# EAGLE design R3-URC18-4-002-002 (EAGLE 8.3.2)
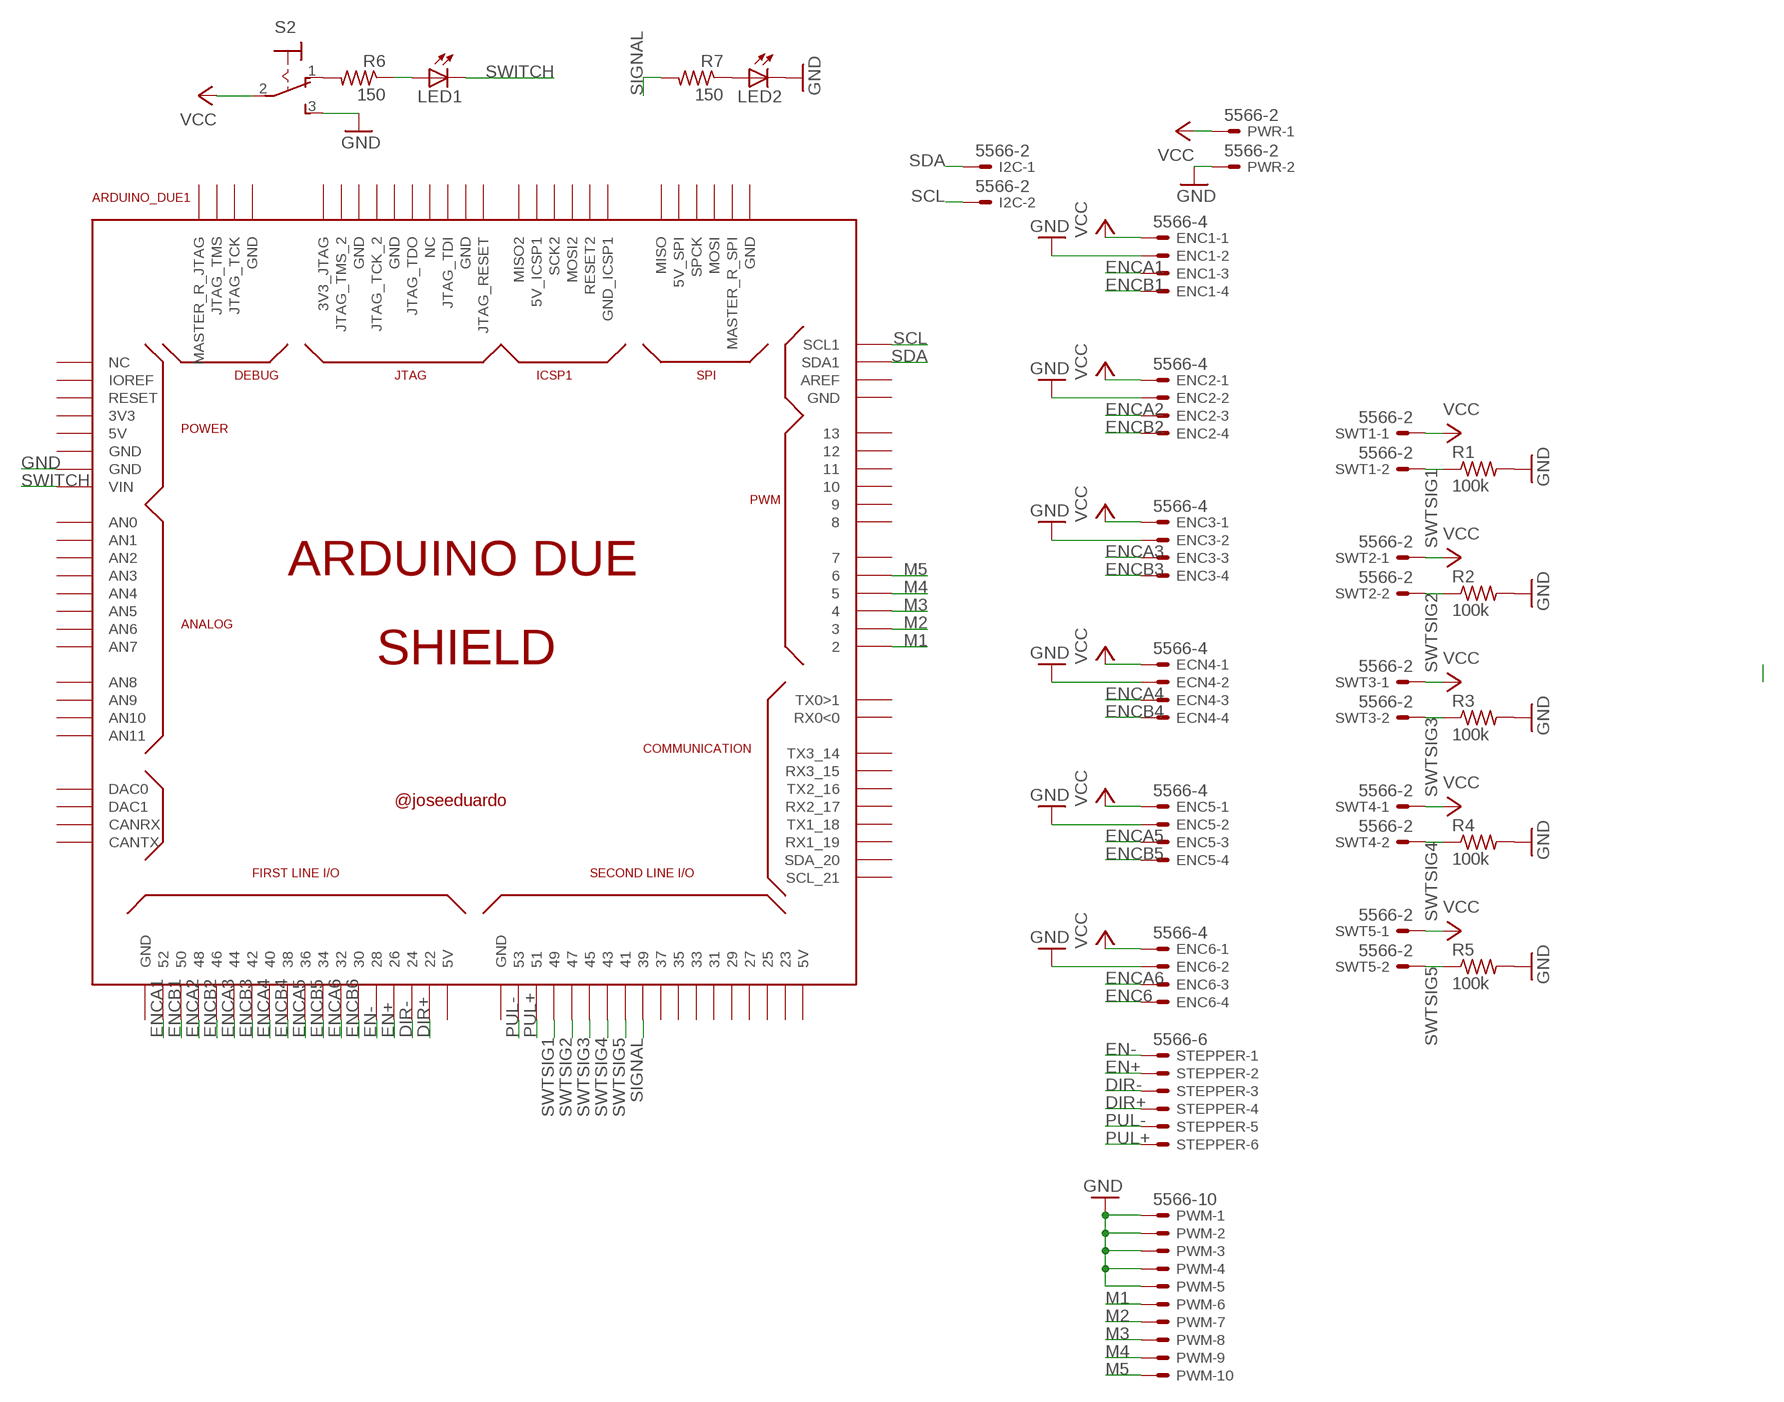
[diagram p0: schematic, sheet 1]

## Parts
ARDUINO_DUE1  ARDUINO_DUE_SHIELD  [ARDUINO_DUE_SHIELD]
ECN4  5566-4  [5566-4]
ENC1  5566-4  [5566-4]
ENC2  5566-4  [5566-4]
ENC3  5566-4  [5566-4]
ENC5  5566-4  [5566-4]
ENC6  5566-4  [5566-4]
I2C  5566-2  [5566-2]
LED1  LED5MM  [LED5MM]
LED2  LED5MM  [LED5MM]
PWM  5566-10  [5566-10]
PWR  5566-2  [5566-2]
R1  100k  R-US_0207/10  [0207/10]
R2  100k  R-US_0207/10  [0207/10]
R3  100k  R-US_0207/10  [0207/10]
R4  100k  R-US_0207/10  [0207/10]
R5  100k  R-US_0207/10  [0207/10]
R6  150  R-US_0207/10  [0207/10]
R7  150  R-US_0207/10  [0207/10]
S2  M9040P  [M9040P]
STEPPER  5566-6  [5566-6]
SWT1  5566-2  [5566-2]
SWT2  5566-2  [5566-2]
SWT3  5566-2  [5566-2]
SWT4  5566-2  [5566-2]
SWT5  5566-2  [5566-2]

## Nets
DIR+: ARDUINO_DUE1.22 STEPPER.4
DIR-: ARDUINO_DUE1.24 STEPPER.3
EN+: ARDUINO_DUE1.26 STEPPER.2
EN-: ARDUINO_DUE1.28 STEPPER.1
ENC6: ENC6.4
ENCA1: ARDUINO_DUE1.52 ENC1.3
ENCA2: ARDUINO_DUE1.48 ENC2.3
ENCA3: ARDUINO_DUE1.44 ENC3.3
ENCA4: ARDUINO_DUE1.40 ECN4.3
ENCA5: ARDUINO_DUE1.36 ENC5.3
ENCA6: ARDUINO_DUE1.32 ENC6.3
ENCB1: ARDUINO_DUE1.50 ENC1.4
ENCB2: ARDUINO_DUE1.46 ENC2.4
ENCB3: ARDUINO_DUE1.42 ENC3.4
ENCB4: ARDUINO_DUE1.38 ECN4.4
ENCB5: ARDUINO_DUE1.34 ENC5.4
ENCB6: ARDUINO_DUE1.30
GND: ARDUINO_DUE1.GND_1(GND) ECN4.2 ENC1.2 ENC2.2 ENC3.2 ENC5.2 ENC6.2 LED2.K(C) PWM.1 PWM.2 PWM.3 PWM.4 PWM.5 PWR.2 R1.2 R2.2 R3.2 R4.2 R5.2 S2.3(S)
M1: ARDUINO_DUE1.2 PWM.6
M2: ARDUINO_DUE1.3 PWM.7
M3: ARDUINO_DUE1.4 PWM.8
M4: ARDUINO_DUE1.5 PWM.9
M5: ARDUINO_DUE1.6 PWM.10
N$1: R6.2 S2.1(O)
N$2: LED1.A R6.1
N$3: LED2.A R7.1
PUL+: ARDUINO_DUE1.51 STEPPER.6
PUL-: ARDUINO_DUE1.53 STEPPER.5
SCL: ARDUINO_DUE1.SCL1 I2C.2
SDA: ARDUINO_DUE1.SDA1 I2C.1
SIGNAL: ARDUINO_DUE1.39 R7.2
SWITCH: ARDUINO_DUE1.VIN LED1.K(C)
SWTSIG1: ARDUINO_DUE1.49 R1.1 SWT1.2
SWTSIG2: ARDUINO_DUE1.47 R2.1 SWT2.2
SWTSIG3: ARDUINO_DUE1.45 R3.1 SWT3.2
SWTSIG4: ARDUINO_DUE1.43 R4.1 SWT4.2
SWTSIG5: ARDUINO_DUE1.41 R5.1 SWT5.2
VCC: ECN4.1 ENC1.1 ENC2.1 ENC3.1 ENC5.1 ENC6.1 PWR.1 S2.2(P) SWT1.1 SWT2.1 SWT3.1 SWT4.1 SWT5.1
Unconnected: ARDUINO_DUE1.0(RX0<0) ARDUINO_DUE1.1(TX0>1) ARDUINO_DUE1.3V3 ARDUINO_DUE1.3V3_JTAG ARDUINO_DUE1.5V0(5V) ARDUINO_DUE1.5V0_1(5V) ARDUINO_DUE1.5V0_2(5V) ARDUINO_DUE1.5V_2(5V_SPI) ARDUINO_DUE1.5V_ICSP1 ARDUINO_DUE1.7 ARDUINO_DUE1.8 ARDUINO_DUE1.9 ARDUINO_DUE1.10 ARDUINO_DUE1.11 ARDUINO_DUE1.12 ARDUINO_DUE1.13 ARDUINO_DUE1.14(TX3_14) ARDUINO_DUE1.15(RX3_15) ARDUINO_DUE1.16(TX2_16) ARDUINO_DUE1.17(RX2_17) ARDUINO_DUE1.18(TX1_18) ARDUINO_DUE1.19(RX1_19) ARDUINO_DUE1.20(SDA_20) ARDUINO_DUE1.21(SCL_21) ARDUINO_DUE1.23 ARDUINO_DUE1.25 ARDUINO_DUE1.27 ARDUINO_DUE1.29 ARDUINO_DUE1.31 ARDUINO_DUE1.33 ARDUINO_DUE1.35 ARDUINO_DUE1.37 ARDUINO_DUE1.A0(AN0) ARDUINO_DUE1.A1(AN1) ARDUINO_DUE1.A2(AN2) ARDUINO_DUE1.A3(AN3) ARDUINO_DUE1.A4(AN4) ARDUINO_DUE1.A5(AN5) ARDUINO_DUE1.A6(AN6) ARDUINO_DUE1.A7(AN7) ARDUINO_DUE1.A8(AN8) ARDUINO_DUE1.A9(AN9) ARDUINO_DUE1.A10(AN10) ARDUINO_DUE1.A11(AN11) ARDUINO_DUE1.AREF ARDUINO_DUE1.CANRX ARDUINO_DUE1.CANTX ARDUINO_DUE1.DAC0 ARDUINO_DUE1.DAC1 ARDUINO_DUE1.GND ARDUINO_DUE1.GND_2(GND) ARDUINO_DUE1.GND_3(GND) ARDUINO_DUE1.GND_4(GND) ARDUINO_DUE1.GND_5(GND) ARDUINO_DUE1.GND_7(GND) ARDUINO_DUE1.GND_8(GND) ARDUINO_DUE1.GND_9(GND) ARDUINO_DUE1.GND_10(GND) ARDUINO_DUE1.GND_ICSP1 ARDUINO_DUE1.IOREF ARDUINO_DUE1.JTAG_RESET ARDUINO_DUE1.JTAG_TCK ARDUINO_DUE1.JTAG_TCK_2 ARDUINO_DUE1.JTAG_TDI ARDUINO_DUE1.JTAG_TDO ARDUINO_DUE1.JTAG_TMS ARDUINO_DUE1.JTAG_TMS_2 ARDUINO_DUE1.MASTER_RESET_JTAG(MASTER_R_JTAG) ARDUINO_DUE1.MASTER_RESET_SPI(MASTER_R_SPI) ARDUINO_DUE1.MISO ARDUINO_DUE1.MISO2 ARDUINO_DUE1.MOSI ARDUINO_DUE1.MOSI2 ARDUINO_DUE1.NC_2(NC) ARDUINO_DUE1.NC_5(NC) ARDUINO_DUE1.RESET ARDUINO_DUE1.RESET2 ARDUINO_DUE1.SCK2 ARDUINO_DUE1.SPCK

## Library data of the parts
ARDUINO_DUE1 = arduino_due_shield:ARDUINO_DUE_SHIELD
ECN4 ENC1-ENC3 ENC5 ENC6 = con-molex:5566-4: Mini FIT connector 4 pol Source: http://www.molex.com; OC_FARNELL: unknown; OC_NEWARK: unknown
I2C PWR SWT1-SWT5 = con-molex:5566-2: Mini FIT connector 2 pol Source: http://www.molex.com; OC_FARNELL: 1822072; OC_NEWARK: unknown
LED1 LED2 = led:LED: LED OSRAM: - CHIPLED LG R971, LG N971, LY N971, LG Q971, LY Q971, LO R971, LY R971 LH N974, LH R974 LS Q976, LO Q976, LY Q976 LO Q996 - Hyper CHIPLED LW Q18S LB Q993, LB Q99A, LB R99A - SideLED LS A670, LO A670, LY A670, LG A670, LP A670 LB A673, LV A673, LT A673, LW A673 LH A674 LY A675 LS A676, LA A676, LO A676, LY A676, LW A676 LS A679, LY A679, LG A679 - Hyper Micro SIDELED® LS Y876, LA Y876, LO Y876, LY Y876 LT Y87S - SmartLED LW L88C, LW L88S LB L89C, LB L89S, LG L890 LS L89K, LO L89K, LY L89K LS L896, LA L896, LO L896, LY L896 - TOPLED LS T670, LO T670, LY T670, LG T670, LP T670 LSG T670, LSP T670, LSY T670, LOP T670, LYG T670 LG T671, LOG T671, LSG T671 LB T673, LV T673, LT T673, LW T673 LH T674 LS T676, LA T676, LO T676, LY T676, LB T676, LH T676, LSB T676, LW T676 LB T67C, LV T67C, LT T67C, LS T67K, LO T67K, LY T67K, LW E67C LS E67B, LA E67B, LO E67B, LY E67B, LB E67C, LV E67C, LT E67C LW T67C LS T679, LY T679, LG T679 LS T770, LO T770, LY T770, LG T770, LP T770 LB T773, LV T773, LT T773, LW T773 LH T774 LS E675, LA E675, LY E675, LS T675 LS T776, LA T776, LO T776, LY T776, LB T776 LHGB T686 LT T68C, LB T68C - Hyper Mini TOPLED® LB M676 - Mini TOPLED Santana® LG M470 LS M47K, LO M47K, LY M47K Source: http://www.osram.convergy.de LUXEON: - LUMILED® LXK2-PW12-R00, LXK2-PW12-S00, LXK2-PW14-U00, LXK2-PW14-V00 LXK2-PM12-R00, LXK2-PM12-S00, LXK2-PM14-U00 LXK2-PE12-Q00, LXK2-PE12-R00, LXK2-PE12-S00, LXK2-PE14-T00, LXK2-PE14-U00 LXK2-PB12-K00, LXK2-PB12-L00, LXK2-PB12-M00, LXK2-PB14-N00, LXK2-PB14-P00, LXK2-PB14-Q00 LXK2-PR12-L00, LXK2-PR12-M00, LXK2-PR14-Q00, LXK2-PR14-R00 LXK2-PD12-Q00, LXK2-PD12-R00, LXK2-PD12-S00 LXK2-PH12-R00, LXK2-PH12-S00 LXK2-PL12-P00, LXK2-PL12-Q00, LXK2-PL12-R00 Source: www.luxeon.com KINGBRIGHT: KA-3528ASYC Source: www.kingbright.com
PWM = con-molex:5566-10: Mini FIT connector 10 pol Source: http://www.molex.com; OC_FARNELL: unknown; OC_NEWARK: unknown
R1-R7 = resistor:R-US_: RESISTOR, American symbol
S2 = switch:M9040P: TOGGLE SWITCH Marquardt
STEPPER = con-molex:5566-6: Mini FIT connector 6 pol Source: http://www.molex.com; MPN: 95566-61002; OC_FARNELL: unknown; OC_NEWARK: 22K8620

## Board
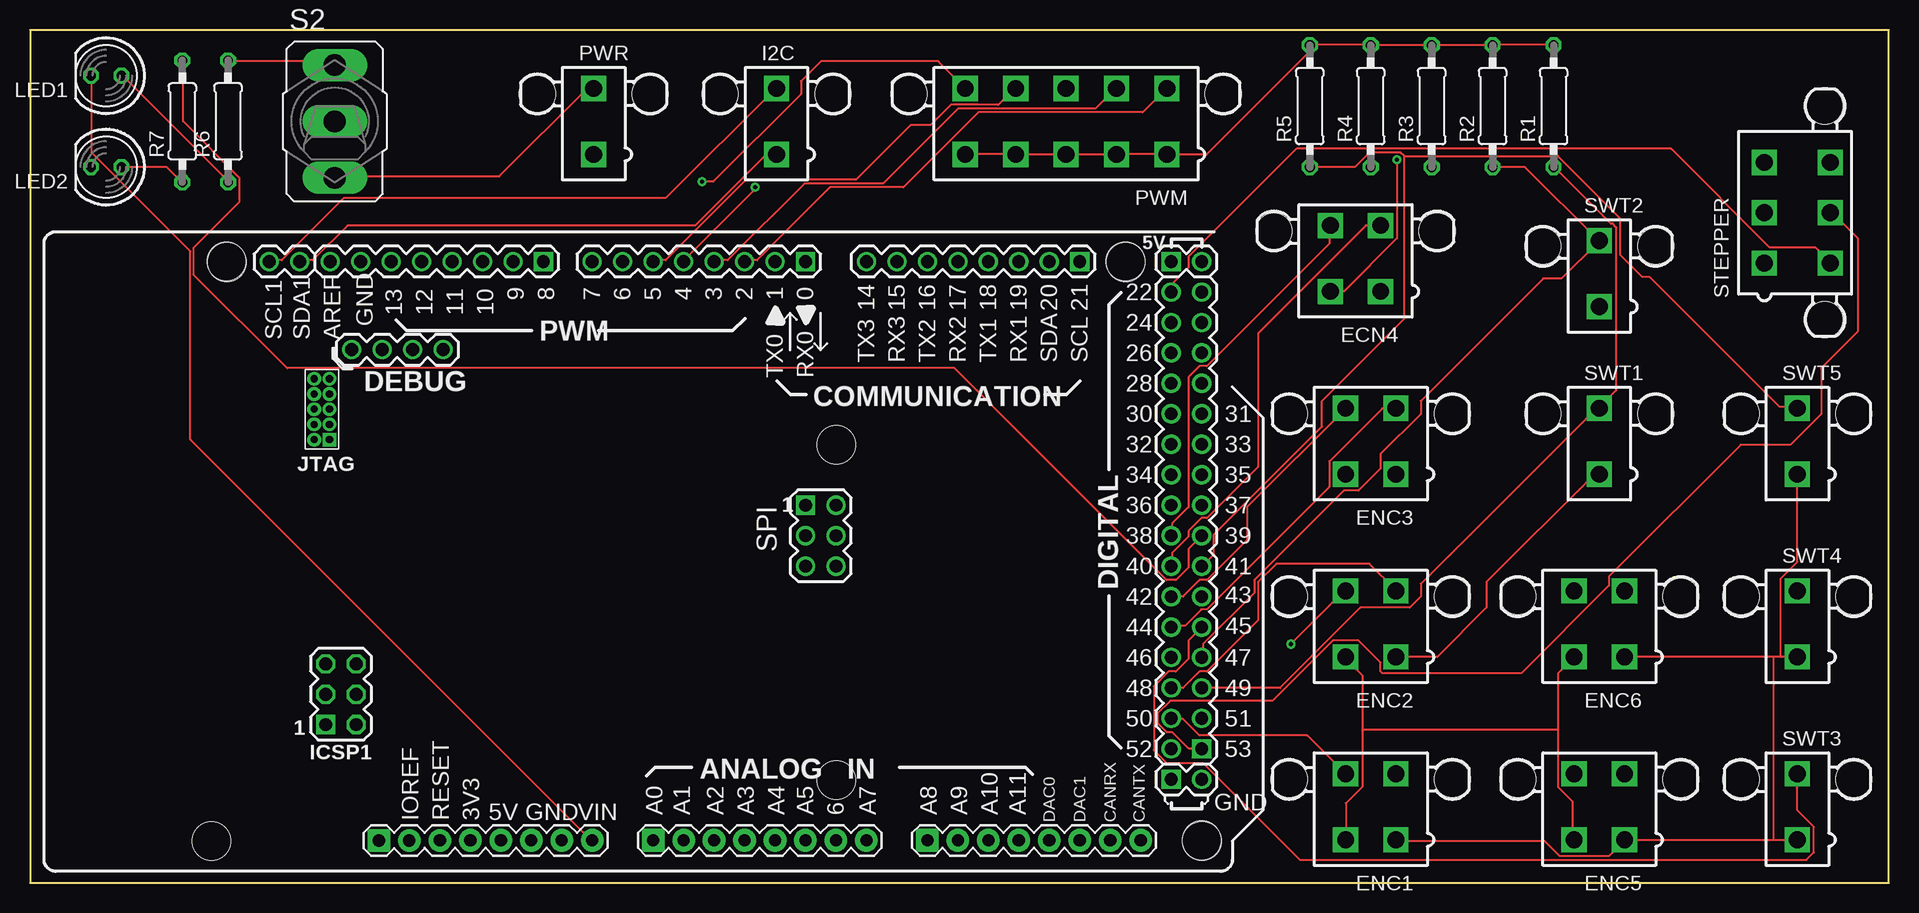
[diagram p1: board, top side]
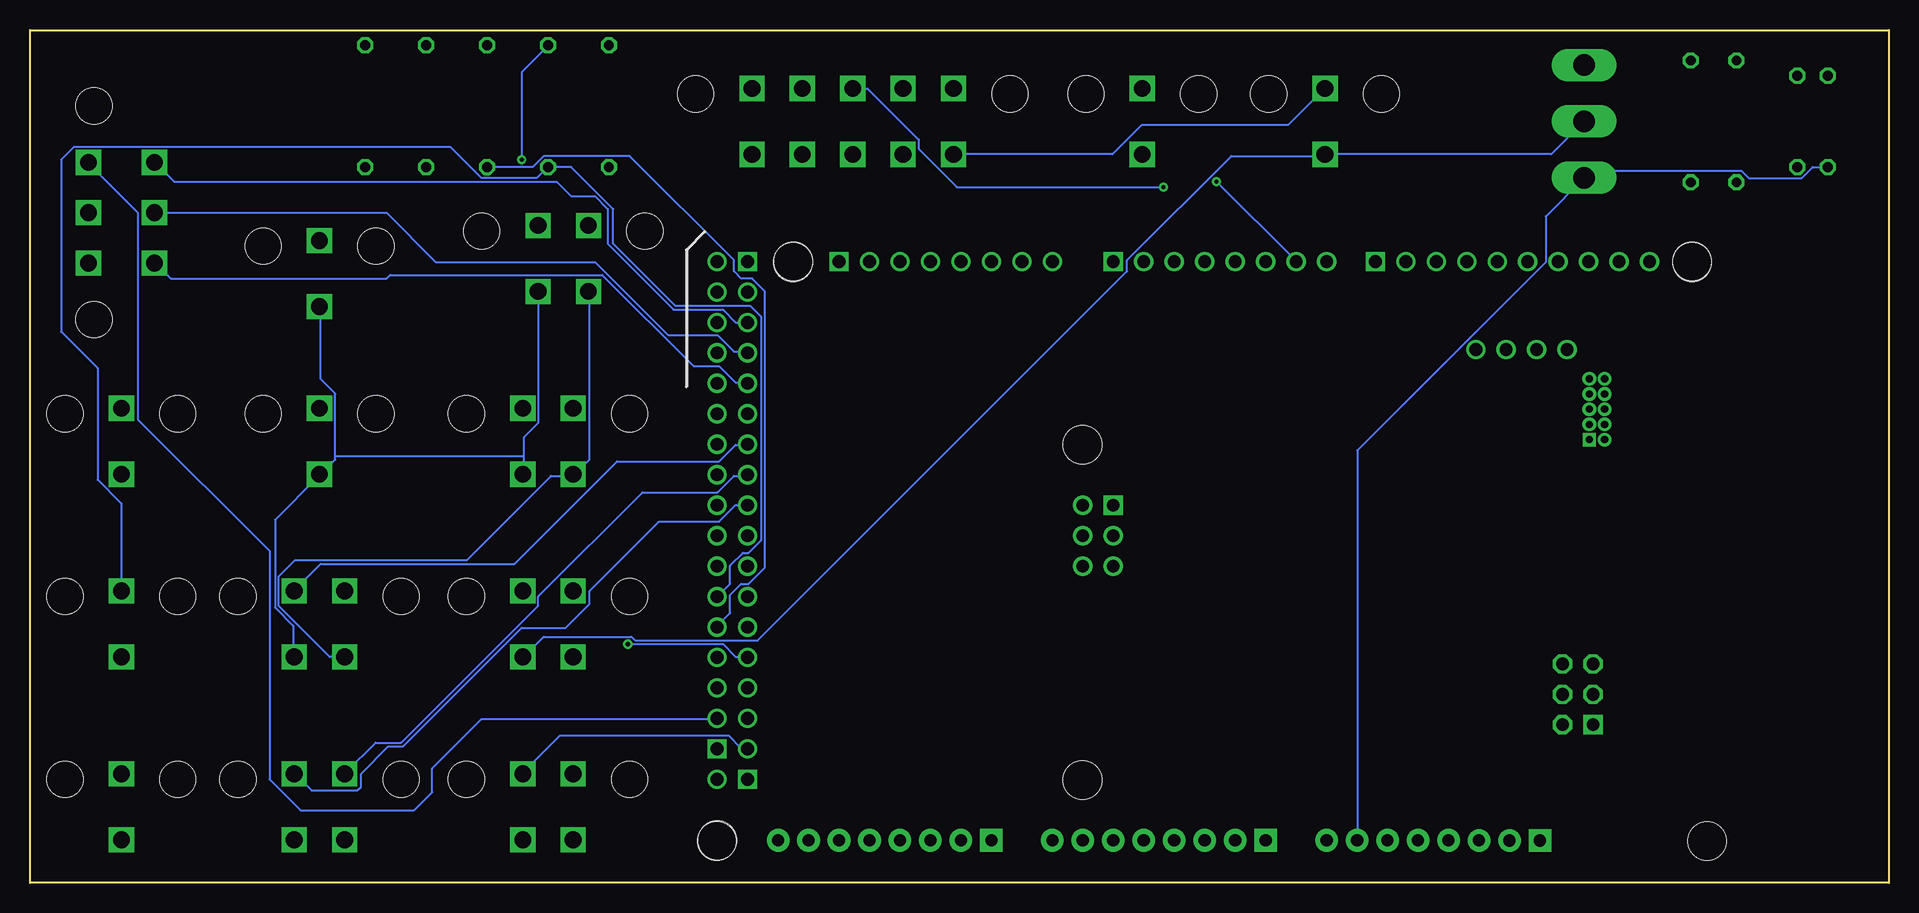
[diagram p2: board, bottom side, seen from below]

Size 154.94 x 71.12 mm. Coordinates in mm from the lower left corner, seen from the top.
Outline: 0,0 154.94,0 154.94,71.12 0,71.12 0,0
Copper layers (1*16): Top 0.035mm / dielectric 1.5mm / Bottom 0.035mm
Design rules "default": minimum track width 6mil, minimum drill 0.35mm, track to track 6mil, track to pad 6mil, pad to pad 6mil, via to via 6mil, smd to smd 6mil, copper to edge 40mil, drill to drill 6mil, minimum pad ring 10mil, minimum via ring 8mil, stop-mask expansion 4mil, vias tented up to drill 0mil, thermal gap 10mil

### Footprints (pad centres in the part's own frame; a part is rotated, then mirrored left to right if it is on the bottom)
ARDUINO_DUE_SHIELD = drill 1.067 square: 0 63.373,51.816; 5V0_1 93.853,51.816; 8 41.529,51.816; 21 86.233,51.816; 53 96.393,11.176; GND_2 93.853,8.636; MISO 63.373,31.496; MISO2 23.384,13.196 | drill 1.067: 1 60.833,51.816; 2 58.293,51.816; 3 55.753,51.816; 4 53.213,51.816; 5 50.673,51.816; 5V0_2 96.393,51.816; 5V_2 65.913,31.496; 6 48.133,51.816; 7 45.593,51.816; 9 38.989,51.816; 10 36.449,51.816; 11 33.909,51.816; 12 31.369,51.816; 13 28.829,51.816; 14 68.453,51.816; 15 70.993,51.816; 16 73.533,51.816; 17 76.073,51.816; 18 78.613,51.816; 19 81.153,51.816; 20 83.693,51.816; 22 93.853,49.276; 23 96.393,49.276; 24 93.853,46.736; 25 96.393,46.736; 26 93.853,44.196; 27 96.393,44.196; 28 93.853,41.656; 29 96.393,41.656; 30 93.853,39.116; 31 96.393,39.116; 32 93.853,36.576; 33 96.393,36.576; 34 93.853,34.036; 35 96.393,34.036; 36 93.853,31.496; 37 96.393,31.496; 38 93.853,28.956; 39 96.393,28.956; 40 93.853,26.416; 41 96.393,26.416; 42 93.853,23.876; 43 96.393,23.876; 44 93.853,21.336; 45 96.393,21.336; 46 93.853,18.796; 47 96.393,18.796; 48 93.853,16.256; 49 96.393,16.256; 50 93.853,13.716; 51 96.393,13.716; 52 93.853,11.176; AREF 23.749,51.816; GND_3 96.393,8.636; GND_4 26.289,51.816; GND_5 65.913,26.416; GND_7 33.161,44.473; JTAG_TCK 30.621,44.473; JTAG_TMS 28.081,44.473; MASTER_RESET_JTAG 25.541,44.473; MASTER_RESET_SPI 63.373,26.416; MOSI 65.913,28.956; SCL1 18.669,51.816; SDA1 21.209,51.816; SPCK 63.373,28.956 | drill 1.016 pad 1.88: 3V3 35.433,3.556; 5V0 37.973,3.556; A1 53.213,3.556; A2 55.753,3.556; A3 58.293,3.556; A4 60.833,3.556; A5 63.373,3.556; A6 65.913,3.556; A7 68.453,3.556; A9 76.073,3.556; A10 78.613,3.556; A11 81.153,3.556; CANRX 88.773,3.556; CANTX 91.313,3.556; DAC0 83.693,3.556; DAC1 86.233,3.556; GND 40.513,3.556; GND_1 43.053,3.556; IOREF 30.346,3.543; RESET 32.893,3.555; VIN 45.593,3.556 | drill 0.6 pad 1.016 square: 3V3_JTAG 23.689,36.964 | drill 1.067 octagon: 5V_ICSP1 25.924,13.196; GND_ICSP1 25.924,18.276; MOSI2 25.924,15.736; RESET2 23.384,18.276; SCK2 23.384,15.736 | drill 1.016 pad 1.88 square: A0 50.673,3.556; A8 73.533,3.556; NC_2 27.806,3.543 | drill 0.6 pad 1.143: GND_8 23.689,38.234; GND_9 23.689,40.774; GND_10 23.689,42.044; JTAG_RESET 22.419,42.044; JTAG_TCK_2 22.419,38.234; JTAG_TDI 22.419,40.774; JTAG_TDO 22.419,39.504; JTAG_TMS_2 22.419,36.964; NC_5 23.689,39.504 | hole 3.2: 15.113,51.816; 90.043,51.816; 96.393,3.556; 96.418,3.505; 15.138,51.765; 90.068,51.765; 13.868,3.505; 65.938,36.525; 65.938,8.585
5566-4 = drill 1.4 square: 1 2.1,-2.75; 2 -2.1,-2.75; 3 2.1,2.75; 4 -2.1,2.75 | hole 3: 6.8,2.29; -6.8,2.29
5566-2 = drill 1.4 square: 1 0,-2.75; 2 0,2.75 | hole 3: 4.7,2.29; -4.7,2.29
LED5MM = drill 0.813 octagon: A -1.27,0; K 1.27,0
5566-10 = drill 1.4 square: 1 8.4,-2.75; 2 4.2,-2.75; 3 0,-2.75; 4 -4.2,-2.75; 5 -8.4,-2.75; 6 8.4,2.75; 7 4.2,2.75; 8 0,2.75; 9 -4.2,2.75; 10 -8.4,2.75 | hole 3: 13.1,2.29; -13.1,2.29
0207/10 = drill 0.813 octagon: 1 -5.08,0; 2 5.08,0
M9040P = drill 1.803 long: 1 0,4.699; 2 0,0; 3 0,-4.699
5566-6 = drill 1.4 square: 1 4.2,-2.75; 2 0,-2.75; 3 -4.2,-2.75; 4 4.2,2.75; 5 0,2.75; 6 -4.2,2.75 | hole 3: 8.9,2.29; -8.9,2.29

### Placement (x,y rotation side)
ARDUINO_DUE1  1.27,0 0 top
ECN4  110.49,52.07 0 top
ENC1  111.76,6.35 0 top
ENC2  111.76,21.59 0 top
ENC3  111.76,36.83 0 top
ENC5  130.81,6.35 0 top
ENC6  130.81,21.59 0 top
I2C  62.23,63.5 0 top
LED1  6.35,67.31 180 top
LED2  6.35,59.69 180 top
PWM  86.36,63.5 0 top
PWR  46.99,63.5 0 top
R1  127,64.77 90 top
R2  121.92,64.77 90 top
R3  116.84,64.77 90 top
R4  111.76,64.77 90 top
R5  106.68,64.77 90 top
R6  16.51,63.5 90 top
R7  12.7,63.5 90 top
S2  25.4,63.5 0 top
STEPPER  147.32,55.88 270 top
SWT1  130.81,36.83 0 top
SWT2  130.81,50.8 0 top
SWT3  147.32,6.35 0 top
SWT4  147.32,21.59 0 top
SWT5  147.32,36.83 0 top

### Tracks (layer width: path | path; a pad name or v marks a point on that pad's centre or on a via)
DIR+
  Top 0.152: ARDUINO_DUE1.22 95.2,49.33 95.2,49.94 96.57,51.31 96.57,52.22 105.56,61.21 136.8,61.21 145.03,52.98 148.84,52.98 150.06,51.76 STEPPER.4
DIR-
  Bottom 0.152: ARDUINO_DUE1.24 96.11,46.74 97.18,47.8 101.3,47.8 106.78,53.29 106.78,56.18 107.85,57.25 109.83,57.25 111.05,58.47 142.9,58.47 144.42,59.99 STEPPER.3
EN+
  Bottom 0.152: STEPPER.2 125.22,55.88 121.11,51.76 107.85,51.76 101.75,45.67 97.64,45.67 96.27,44.3 95.2,44.3 ARDUINO_DUE1.26
EN-
  Bottom 0.152: ARDUINO_DUE1.28 95.2,41.71 96.11,41.71 97.48,43.08 99.62,43.08 107.24,50.7 124.92,50.7 125.22,50.39 143.21,50.39 144.42,51.61 STEPPER.1
ENCA1
  Bottom 0.152: ARDUINO_DUE1.52 95.2,11.23 95.66,11.23 96.72,12.29 110.74,12.29 113.79,9.25 ENC1.3
ENCA2
  Top 0.152: ARDUINO_DUE1.48 96.11,16.26 97.48,17.63 98.09,17.63 102.36,21.89 102.36,25.09 103.89,26.62 111.66,26.62 113.79,24.49 ENC2.3
ENCA3
  Top 0.152: ARDUINO_DUE1.44 95.2,21.44 96.27,21.44 97.64,22.81 98.09,22.81 108.31,33.02 108.31,35.15 112.73,39.57 113.79,39.57 ENC3.3
ENCA4
  Top 0.152: ARDUINO_DUE1.40 95.2,26.47 95.2,27.53 96.57,28.91 96.57,29.36 97.64,30.43 98.09,30.43 102.36,34.7 102.36,45.82 111.35,54.81 112.57,54.81 ECN4.3
ENCA5
  Bottom 0.152: ARDUINO_DUE1.36 96.11,31.5 97.48,30.12 102.51,30.12 108.31,24.33 108.31,23.27 110.29,21.29 113.94,21.29 123.85,11.38 125.07,11.38 127.36,9.09 127.36,8.03 127.66,7.72 131.47,7.72 132.84,9.09 ENC5.3
ENCA6
  Bottom 0.152: ARDUINO_DUE1.32 95.2,36.52 96.11,36.52 97.48,35.15 106.02,35.15 114.55,26.62 130.71,26.62 132.84,24.49 ENC6.3
ENCB1
  Top 0.152: ARDUINO_DUE1.50 95.2,13.67 96.11,13.67 97.48,12.29 106.48,12.29 109.53,9.25 ENC1.4
ENCB2  (via drill 0.35)
  Top 0.152: v105.11,19.91 109.53,24.33 ENC2.4
  Bottom 0.152: v105.11,19.91 97.18,19.91 96.11,18.85 95.2,18.85 ARDUINO_DUE1.46
ENCB3
  Top 0.152: ARDUINO_DUE1.42 96.11,23.88 97.48,25.25 98.09,25.25 101.45,28.6 101.45,31.34 109.68,39.57 ENC3.4
ENCB4
  Top 0.152: ARDUINO_DUE1.38 95.2,29.06 95.2,29.97 96.57,31.34 96.57,42.16 97.48,43.08 98.09,43.08 108.31,53.29 108.31,54.81 ECN4.4
ENCB5
  Bottom 0.152: ARDUINO_DUE1.34 95.2,33.93 96.27,33.93 97.64,32.56 103.89,32.56 112.57,23.88 112.57,23.11 124,11.68 126.14,11.68 128.57,9.25 ENC5.4
GND  (via drill 0.35)
  Top 0.152: 111.05,12.75 111.05,17.32 109.68,18.69 ENC2.2 | 111.05,12.75 111.05,8.03 109.68,6.65 109.68,3.61 ENC1.2 | 127.36,12.75 127.36,17.48 128.57,18.69 ENC6.2 | 127.36,12.75 127.36,8.03 128.57,6.81 128.57,3.61 ENC5.2 | 127.36,12.75 111.05,12.75 | R1.2 126.9,69.9 122.02,69.9 R2.2 121.87,69.9 116.84,69.9 | 116.84,69.9 111.81,69.9 R4.2 111.66,69.9 106.78,69.9 R5.2 106.63,69.75 106.63,69.29 98.09,60.76 94.89,60.76 PWM.1 94.74,60.76 90.63,60.76 PWM.2 90.48,60.76 PWM.3 | 116.84,69.9 R3.2 | PWM.5 77.98,60.76 82.09,60.76 PWM.4 82.25,60.76 PWM.3 | PWM.3 | PWR.2 46.89,66.24 46.43,66.24 39.12,58.93 25.4,58.93 S2.3 | v113.94,60.3 113.94,53.75 109.53,49.33 108.46,49.33 ECN4.2
  Bottom 0.152: ECN4.2 108.31,49.17 108.31,35.31 109.53,34.09 ENC3.2 109.68,33.93 111.51,33.93 118.52,26.92 132.84,26.92 134.21,25.55 134.21,23.11 129.95,18.85 128.73,18.85 ENC6.2 | LED2.K 6.35,59.69 7.26,58.78 11.68,58.78 12.29,59.38 24.94,59.38 25.4,58.93 S2.3 25.4,58.78 28.6,55.57 28.6,51.76 44.3,36.07 44.3,3.61 ARDUINO_DUE1.GND_1 | PWM.5 77.83,60.76 64.72,60.76 62.28,63.2 50.09,63.2 47.04,66.24 PWR.2 | v113.94,60.3 113.94,67.62 111.81,69.75 R4.2
M1
  Top 0.152: ARDUINO_DUE1.2 59.69,51.92 60.6,51.92 66.7,58.01 72.8,58.01 79.05,64.26 92.76,64.26 94.74,66.24 PWM.6
M2
  Top 0.152: ARDUINO_DUE1.3 57.1,51.92 58.17,51.92 64.57,58.32 71.12,58.32 77.37,64.57 88.8,64.57 90.48,66.24 PWM.7
M3  (via drill 0.35)
  Top 0.152: v60.45,58.01 60.45,57.86 54.51,51.92 ARDUINO_DUE1.4
  Bottom 0.152: v60.45,58.01 77.67,58.01 80.87,61.21 80.87,61.98 85.14,66.24 PWM.8
M4
  Top 0.152: ARDUINO_DUE1.5 52.07,51.92 52.98,51.92 59.69,58.62 68.83,58.62 73.41,63.2 75.08,63.2 76.76,64.87 80.72,64.87 82.09,66.24 PWM.9
M5  (via drill 0.35)
  Top 0.152: v56.03,58.47 56.95,58.47 64.26,65.79 64.26,66.85 65.94,68.53 75.69,68.53 77.83,66.4 PWM.10
  Bottom 0.152: v56.03,58.47 49.48,51.92 ARDUINO_DUE1.6
N$1
  Top 0.152: R6.2 16.56,68.53 25.09,68.53 25.4,68.22 S2.1
N$2
  Top 0.152: LED1.A 7.72,67.31 16.56,58.47 R6.1
N$3
  Top 0.152: LED2.A 11.38,59.69 12.6,58.47 R7.1
PUL+
  Bottom 0.152: ARDUINO_DUE1.51 97.79,13.67 117.3,13.67 121.41,9.55 121.41,7.57 122.94,6.04 132.38,6.04 134.98,8.64 134.98,27.69 145.95,38.66 145.95,55.88 150.06,59.99 STEPPER.6
PUL-
  Top 0.152: ARDUINO_DUE1.53 97.64,11.23 96.57,11.23 95.2,12.6 94.74,12.6 93.98,13.36 93.98,14.12 95.05,15.19 103.58,15.19 108.61,20.22 110.74,20.22 112.57,18.39 112.57,17.63 112.73,17.48 124.31,17.48 131.62,24.79 131.62,25.55 142.6,36.52 146.71,36.52 149.3,39.12 149.3,42.93 152.35,45.97 152.35,53.75 150.22,55.88 STEPPER.5
SCL
  Top 0.152: ARDUINO_DUE1.SCL1 20.07,51.92 20.98,51.92 26.16,57.1 52.98,57.1 62.13,66.24 I2C.2
SDA
  Top 0.152: ARDUINO_DUE1.SDA1 22.5,51.92 23.57,51.92 26.47,54.81 55.42,54.81 61.21,60.6 62.13,60.6 I2C.1
SIGNAL
  Top 0.152: R7.2 12.75,68.53 12.75,63.5 17.48,58.78 17.48,56.79 13.67,52.98 13.67,50.7 21.44,42.93 77.06,42.93 94.74,25.25 95.5,25.25 96.57,26.31 96.57,27.84 97.64,28.91 ARDUINO_DUE1.39
SWITCH
  Top 0.152: LED1.K 5.13,67.31 5.13,60.91 13.36,52.68 13.36,36.98 46.74,3.61 ARDUINO_DUE1.VIN
SWTSIG1
  Top 0.152: R1.1 127.05,59.69 131.78,54.97 131.93,54.97 132.23,54.66 132.23,41.1 130.86,39.73 SWT1.2 130.71,39.73 115.93,24.94 115.93,23.88 115.01,22.96 110.9,22.96 104.19,16.26 ARDUINO_DUE1.49
SWTSIG2
  Top 0.152: R2.1 124.61,59.69 130.71,53.59 SWT2.2 130.71,53.44 127.66,50.39 126.14,50.39 115.93,40.18 115.93,39.12 112.57,35.76 112.57,34.54 110.74,32.71 109.53,32.71 102.06,25.25 102.06,24.18 97.79,19.91 97.79,18.85 ARDUINO_DUE1.47
SWTSIG3
  Top 0.152: SWT3.2 147.32,6.04 148.69,4.67 148.69,2.54 148.08,1.93 105.87,1.93 97.79,10.01 94.74,10.01 93.68,11.07 93.68,16.41 94.89,17.63 95.5,17.63 96.57,18.69 96.57,20.22 97.64,21.29 ARDUINO_DUE1.45
  Bottom 0.152: R3.1 113.03,59.69 112.12,60.6 104.95,60.6 96.27,51.92 96.27,51 95.66,50.39 94.74,50.39 93.68,49.33 93.68,26.31 95.05,24.94 95.66,24.94 96.57,24.03 96.57,22.5 97.64,21.44 ARDUINO_DUE1.45
SWTSIG4
  Bottom 0.152: ARDUINO_DUE1.43 97.64,23.88 96.57,24.94 96.57,26.47 95.5,27.53 95.05,27.53 93.98,28.6 93.98,47.19 94.89,48.11 101.14,48.11 106.32,53.29 106.32,56.18 109.83,59.69 R4.1 111.81,59.69 112.73,58.78 117.3,58.78 119.89,61.37 151.28,61.37 152.35,60.3 152.35,45.97 149.3,42.93 149.3,33.63 147.32,31.65 SWT4.2
SWTSIG5
  Top 0.152: R5.1 110.44,59.69 111.66,60.91 114.25,60.91 114.55,60.6 | 114.55,60.6 114.55,47.04 107.7,40.18 107.7,38.05 98.7,29.06 98.7,27.38 97.79,26.47 ARDUINO_DUE1.41 | 114.55,60.6 127.36,60.6 132.54,55.42 132.54,52.38 134.37,50.55 134.98,50.55 145.8,39.73 147.32,39.73 SWT5.2
VCC
  Top 0.152: 145.95,18.85 SWT4.1 | 145.95,18.85 145.34,18.85 | 145.34,18.85 132.99,18.85 ENC6.1 | SWT5.1 147.32,26.77 145.95,25.4 145.95,18.85 | ENC1.1 113.94,3.45 126.29,3.45 127.51,2.23 131.62,2.23 132.84,3.45 ENC5.1 132.99,3.61 145.34,3.61 | 145.34,3.61 SWT3.1 | 145.34,3.61 145.34,18.85 | ENC2.1 113.94,18.85 117.3,18.85 121.41,22.96 121.41,25.09 130.25,33.93 130.71,33.93 SWT1.1
  Bottom 0.152: S2.2 28.14,60.76 46.89,60.76 PWR.1 47.04,60.6 54.81,60.6 63.5,51.92 63.5,51 94.28,20.22 104.5,20.22 104.8,20.52 112.12,20.52 113.79,18.85 ENC2.1 | 113.79,35.61 113.79,37.13 112.57,38.35 112.57,49.17 ECN4.1 | 113.79,35.61 113.79,34.09 ENC3.1 | 129.49,35.61 129.49,35.31 130.71,34.09 SWT1.1 130.86,33.93 134.52,30.28 134.52,22.96 132.99,21.44 132.99,18.85 ENC6.1 | 129.49,35.61 129.49,40.79 130.71,42.01 130.71,47.95 SWT2.1 | 129.49,35.61 113.79,35.61